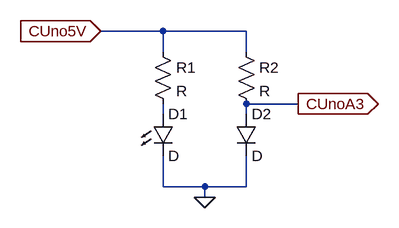
[diagram p0: schematic BeamBreak.asc]
BeamBreak.asc, the LTspice schematic file:
Version 4
SHEET 1 880 680
WIRE 80 48 -16 48
WIRE 208 48 80 48
WIRE 80 80 80 48
WIRE 208 80 208 48
WIRE 288 160 208 160
WIRE 80 176 80 160
WIRE 208 176 208 160
WIRE 80 288 80 240
WIRE 144 288 80 288
WIRE 208 288 208 240
WIRE 208 288 144 288
WIRE 144 304 144 288
FLAG 144 304 0
FLAG -16 48 CUno5V
IOPIN -16 48 In
FLAG 288 160 CUnoA3
IOPIN 288 160 Out
SYMBOL LED 64 176 R0
SYMATTR InstName D1
SYMBOL res 64 64 R0
SYMATTR InstName R1
SYMBOL res 192 64 R0
SYMATTR InstName R2
SYMBOL diode 192 176 R0
SYMATTR InstName D2

The netlist it stands for:
* BeamBreak.asc
D1 N001 0 D
R1 CUno5V N001 R
R2 CUno5V CUnoA3 R
D2 CUnoA3 0 D
.model D D
.lib standard.dio
.backanno
.end